# Altium schematic sheet waku-ctl.SchDoc (part 4 of 5)
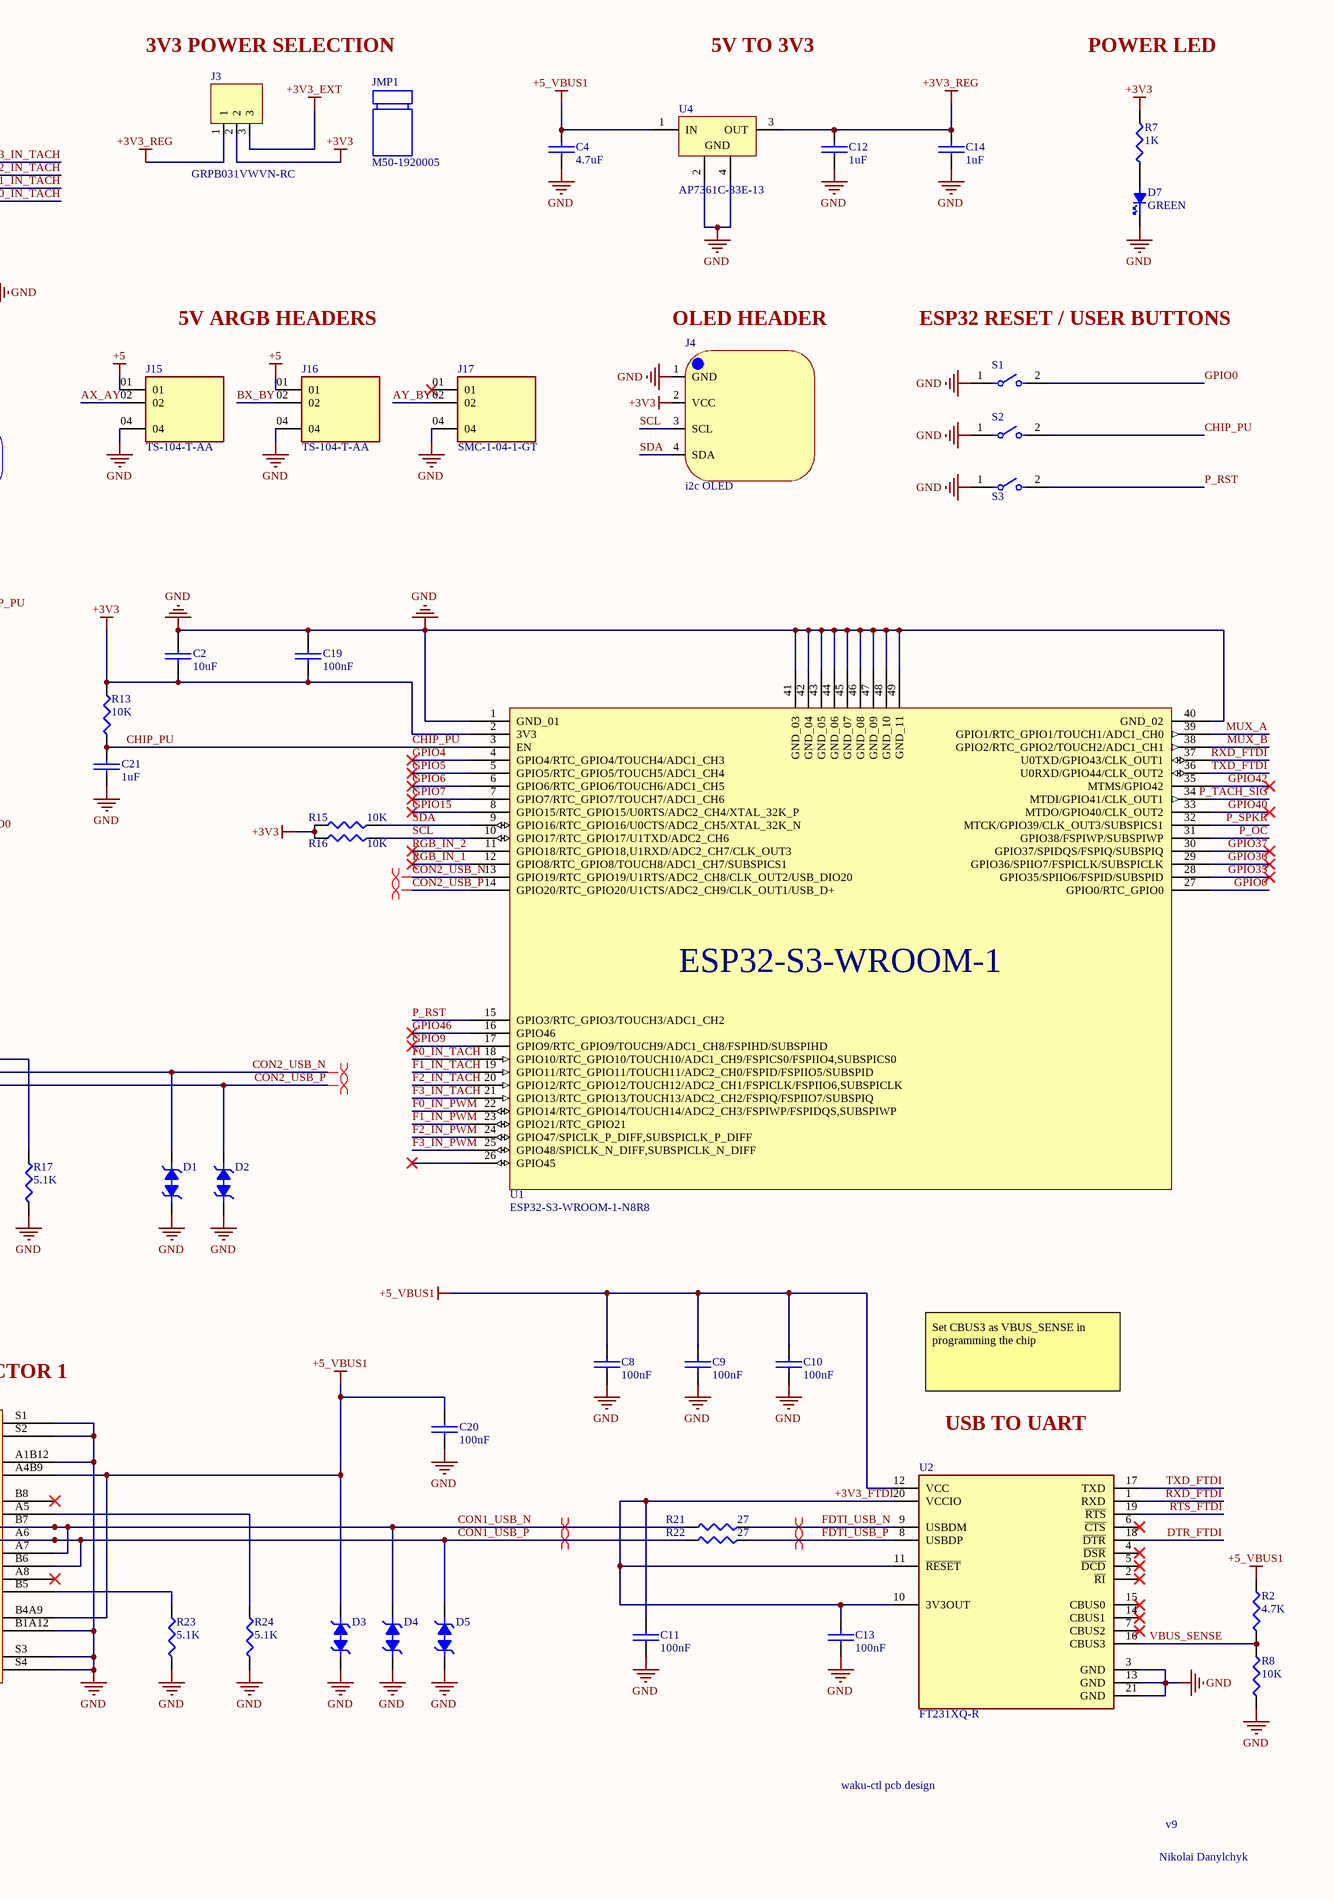
[diagram p4: waku-ctl.SchDoc, right]

## Library data of the parts (continued)
R21 R22 = RC0603FR-0727RL: RES 27 OHM 1% 1/10W 0603; Manufacturer: Yageo Group; Max Power Dissipation: 100mW; Value: 27Ω; Temperature Coefficient: 100ppm/°C; Voltage Rating: 75V; Voltage Rating (AC): 50V; Supplier: DigiKey; Supplier Part Number: 311-27.0HRCT-ND; Manufacturer Part Number: RC0603FR-0727RL; RoHS: Compliant; Category: Chip SMD Resistors; Stock: 368686; Pricing: 1=0.11, 10=0.011, 25=0.0092, 50=0.0052 (USD); Case/Package: 0603; Case Code (Imperial): 0603; China RoHS: Non-Compliant; Composition: Thick Film; Depth: 800µm; Features: Moisture Resistant; Height: 450µm; Lead Free: Lead Free; Length: 1.6mm; Lifecycle Status: Production; Max Operating Temperature: 155°C; Min Operating Temperature: -55°C; Mounting Technology: Surface Mount; Pins: 2; Number of Terminals: 2; Number of Terminations: 2; Packaging: Tape & Reel; Power Dissipation: 100mW; Power Rating: 100mW; REACH SVHC: Yes; Schedule B: 8533210045, 8533210045|8533210045|8533210045|8533210045|8533210045|8533210045|8533210045|8533210045|8533210045|8533210045|8533210045|8533210045|8533210045|8533210045, 8533210045|8533210045|8533210045|8533210045|8533210045|8533210045|8533210045|8533210045|8533210045|8533210045|8533210045|8533210045|8533210045|8533210045|8533210045, 8533210045|8533210045|8533210045|8533210045|8533210045|8533210045|8533210045|8533210045|8533210045|8533210045|8533210045|8533210045|8533210045|8533210045|8533210045|8533210045; Termination: SMD/SMT; Tolerance: 1%; Voltage Rating (DC): 50V; Width: 800µm; Working Voltage: 75V; ComponentLink1URL: https://datasheet.octopart.com:443/RC0603FR-0727RL-Yageo-datasheet-175887523.pdf?src-supplier=Newark; ComponentLink1Description: https://datasheet.octopart.com:443/RC0603FR-0727RL-Yageo-datasheet-175887523.pdf?src-supplier=Newark; ComponentLink2URL: https://datasheet.octopart.com:443/RC0603FR-0727RL-Yageo-datasheet-8328172.pdf?src-supplier=Newark; ComponentLink2Description: https://datasheet.octopart.com:443/RC0603FR-0727RL-Yageo-datasheet-8328172.pdf?src-supplier=Newark; ComponentLink3URL: https://datasheet.octopart.com:443/RC0603FR-0727RL-Yageo-datasheet-34211833.pdf?src-supplier=Newark; ComponentLink3Description: https://datasheet.octopart.com:443/RC0603FR-0727RL-Yageo-datasheet-34211833.pdf?src-supplier=Newark; ComponentLink4URL: https://datasheet.octopart.com:443/RC0603FR-0727RL-Yageo-datasheet-62067350.pdf?src-supplier=Newark; ComponentLink4Description: https://datasheet.octopart.com:443/RC0603FR-0727RL-Yageo-datasheet-62067350.pdf?src-supplier=Newark; ComponentLink5URL: https://datasheet.octopart.com:443/RC0603FR-0727RL-Yageo-datasheet-103092701.pdf?src-supplier=Upverter; ComponentLink5Description: https://datasheet.octopart.com:443/RC0603FR-0727RL-Yageo-datasheet-103092701.pdf?src-supplier=Upverter; ComponentLink6URL: https://datasheet.octopart.com:443/RC0603FR-0727RL-Yageo-datasheet-164759695.pdf?src-supplier=Future+Electronics; ComponentLink6Description: https://datasheet.octopart.com:443/RC0603FR-0727RL-Yageo-datasheet-164759695.pdf?src-supplier=Future+Electronics; ComponentLink7URL: https://datasheet.octopart.com:443/RC0603FR-0727RL-Yageo-datasheet-137700087.pdf?src-supplier=Future+Electronics; ComponentLink7Description: https://datasheet.octopart.com:443/RC0603FR-0727RL-Yageo-datasheet-137700087.pdf?src-supplier=Future+Electronics; ComponentLink8URL: https://datasheet.octopart.com:443/RC0603FR-0727RL-Yageo-datasheet-27584510.pdf?src-supplier=Future+Electronics; ComponentLink8Description: https://datasheet.octopart.com:443/RC0603FR-0727RL-Yageo-datasheet-27584510.pdf?src-supplier=Future+Electronics; ComponentLink9URL: https://datasheet.octopart.com:443/RC0603FR-0727RL-Yageo-datasheet-15599030.pdf?src-supplier=Future+Electronics; ComponentLink9Description: https://datasheet.octopart.com:443/RC0603FR-0727RL-Yageo-datasheet-15599030.pdf?src-supplier=Future+Electronics; ComponentLink10URL: https://datasheet.octopart.com:443/RC0603FR-0727RL-Yageo-datasheet-12596169.pdf?src-supplier=Future+Electronics; ComponentLink10Description: https://datasheet.octopart.com:443/RC0603FR-0727RL-Yageo-datasheet-12596169.pdf?src-supplier=Future+Electronics; ComponentLink11URL: https://datasheet.octopart.com:443/RC0603FR-0727RL-Yageo-datasheet-8324193.pdf?src-supplier=Future+Electronics; ComponentLink11Description: https://datasheet.octopart.com:443/RC0603FR-0727RL-Yageo-datasheet-8324193.pdf?src-supplier=Future+Electronics; ComponentLink12URL: https://datasheet.octopart.com:443/RC0603FR-0727RL-Yageo-datasheet-148775077.pdf?src-supplier=TME; ComponentLink12Description: https://datasheet.octopart.com:443/RC0603FR-0727RL-Yageo-datasheet-148775077.pdf?src-supplier=TME; ComponentLink13URL: https://datasheet.octopart.com/RC0603FR-0727RL-Yageo-datasheet-73766026.pdf; ComponentLink13Description: https://datasheet.octopart.com/RC0603FR-0727RL-Yageo-datasheet-73766026.pdf; ComponentLink14URL: https://datasheet.octopart.com:443/RC0603FR-0727RL-Yageo-datasheet-118562.pdf?src-supplier=DigiKey; ComponentLink14Description: https://datasheet.octopart.com:443/RC0603FR-0727RL-Yageo-datasheet-118562.pdf?src-supplier=DigiKey; ComponentLink15URL: http://sigma.octopart.com:80/rohs_statement/Yageo-company-2.pdf?src-supplier=Compliance+Statements; ComponentLink15Description: http://sigma.octopart.com:80/rohs_statement/Yageo-company-2.pdf?src-supplier=Compliance+Statements; ComponentLink16URL: http://sigma.octopart.com:80/conflict_mineral_statement/Yageo-company-3.pdf?src-supplier=Compliance+Statements; ComponentLink16Description: http://sigma.octopart.com:80/conflict_mineral_statement/Yageo-company-3.pdf?src-supplier=Compliance+Statements; LCSC Part Number: C137753
S1-S3 = PTS636SMG25JSMTRLFS: SWITCH TACTILE SPST-NO 0.05A 12V; Manufacturer: C&K Components; Contact Resistance: 100mΩ; Electrical Life: 70kcycles; Max Current Rating: 50mA; Number of Positions: 1; Operating Force: 2.06N; Sealable: IP40; Throw Configuration: SPST; Supplier: Newark; Supplier Part Number: 41AJ9861; Manufacturer Part Number: PTS636SMG25JSMTRLFS; RoHS: Compliant; Category: Tactile Switches; Stock: 12000; Pricing: 3000=0.155 (USD); Color: White; Height: 1.9mm; Insulation Resistance: 100MΩ; Length: 6.1mm; Lifecycle Status: Production; Max Operating Temperature: 90°C; Max Voltage Rating (DC): 12V; Min Operating Temperature: -40°C; REACH SVHC: Yes; Schedule B: 8536509065; ComponentLink1URL: https://datasheet.octopart.com:443/PTS636SMG25JSMTRLFS-C%26K-Components-datasheet-180017273.pdf?src-supplier=IHS; ComponentLink1Description: https://datasheet.octopart.com:443/PTS636SMG25JSMTRLFS-C%26K-Components-datasheet-180017273.pdf?src-supplier=IHS; ComponentLink2URL: https://datasheet.octopart.com:443/PTS636SMG25JSMTRLFS-C%26K-Components-datasheet-136360845.pdf?src-supplier=Electro+Sonic; ComponentLink2Description: https://datasheet.octopart.com:443/PTS636SMG25JSMTRLFS-C%26K-Components-datasheet-136360845.pdf?src-supplier=Electro+Sonic; LCSC Part Number: C2689642
SATA_POWER = SATA-15pin-power: SATA 15 pin power connector from aliexpress
SPK1 = HC9042-16: Slim speaker from aliexpress; LCSC Part Number: C49246946
U1 = ESP32-S3-WROOM-1-N8R8: ESP32-S3R8 RF TXRX MOD BT WIFI PCB TH SMD; Manufacturer: Espressif Systems; Max Supply Voltage: 3.6V; Min Supply Voltage: 3V; Operating Supply Voltage: 3.3V; Supplier: DigiKey; Supplier Part Number: 5407-ESP32-S3-WROOM-1-N8R8CT-ND; Manufacturer Part Number: ESP32-S3-WROOM-1-N8R8; RoHS: Compliant; Category: System on Chip (SoC); Stock: 10970; Pricing: 1=5.22, 1=6.13, 10=4.528, 10=5.313, 25=5.22, 25=5.0276, 100=3.9504, 100=4.635, 250=3.75, 250=4.39984, 650=4.17352, 1300=4.02062, 1950=3.93533 (EUR); Height - Seated (Max): 3.25mm; Length: 25.5mm; Max Operating Temperature: 65°C; Min Operating Temperature: -40°C; Number of Terminals: 41; Terminal Pitch: 1.27mm; Width: 18mm; ComponentLink1URL: https://datasheet.octopart.com:443/ESP32-S3-WROOM-1-N8R8-Espressif-Systems-datasheet-165560563.pdf?src-supplier=IHS; ComponentLink1Description: https://datasheet.octopart.com:443/ESP32-S3-WROOM-1-N8R8-Espressif-Systems-datasheet-165560563.pdf?src-supplier=IHS; ComponentLink2URL: https://datasheet.octopart.com:443/ESP32-S3-WROOM-1-N8R8-Espressif-Systems-datasheet-175575506.pdf?src-supplier=SOS+electronic; ComponentLink2Description: https://datasheet.octopart.com:443/ESP32-S3-WROOM-1-N8R8-Espressif-Systems-datasheet-175575506.pdf?src-supplier=SOS+electronic; ComponentLink3URL: https://datasheet.octopart.com:443/ESP32-S3-WROOM-1-N8R8-Espressif-Systems-datasheet-164663773.pdf?src-supplier=SOS+electronic; ComponentLink3Description: https://datasheet.octopart.com:443/ESP32-S3-WROOM-1-N8R8-Espressif-Systems-datasheet-164663773.pdf?src-supplier=SOS+electronic; ComponentLink4URL: https://datasheet.octopart.com:443/ESP32-S3-WROOM-1-N8R8-Espressif-Systems-datasheet-188867343.pdf?src-supplier=TME; ComponentLink4Description: https://datasheet.octopart.com:443/ESP32-S3-WROOM-1-N8R8-Espressif-Systems-datasheet-188867343.pdf?src-supplier=TME; ComponentLink5URL: https://datasheet.octopart.com:443/ESP32-S3-WROOM-1-N8R8-Espressif-Systems-datasheet-165560559.pdf?src-supplier=TME; ComponentLink5Description: https://datasheet.octopart.com:443/ESP32-S3-WROOM-1-N8R8-Espressif-Systems-datasheet-165560559.pdf?src-supplier=TME; LCSC Part Number: C2913201; Parameter 1: *
U2 = FT231XQ-R: IC USB SERIAL FULL UART 20QFN; Manufacturer: FTDI; Data Rate: 12Mbps; Interface: UART, USB; Clock Frequency: 12.02MHz; Max Supply Current: 8.4mA; Max Supply Voltage: 5.5V; Min Supply Voltage: 2.97V; Number of Channels: 1; Operating Supply Current: 8mA; Operating Supply Voltage: 5V; Supplier: DigiKey; Supplier Part Number: 768-1128-6-ND; Manufacturer Part Number: FT231XQ-R; RoHS: Compliant; Category: Interface ICs; Pricing: 1=2.34, 25=2.27, 100=2.2, 250=2, 500=1.82002, 1000=1.7625 (USD); Ambient Temperature Range High: 85°C; Case/Package: QFN; Height: 800µm; Height - Seated (Max): 800µm; Lead Free: Lead Free; Length: 4mm; Lifecycle Status: Production; Max Operating Temperature: 85°C; Min Operating Temperature: -40°C; Mounting Technology: Surface Mount; Pins: 20; Number of Terminals: 20; REACH SVHC: Yes; Terminal Pitch: 500µm; Weight: 123.008581mg; Width: 4mm; ComponentLink1URL: https://datasheet.octopart.com:443/FT231XQ-R-FTDI-datasheet-182343132.pdf?src-supplier=IHS; ComponentLink1Description: https://datasheet.octopart.com:443/FT231XQ-R-FTDI-datasheet-182343132.pdf?src-supplier=IHS; ComponentLink2URL: https://datasheet.octopart.com:443/FT231XQ-R-FTDI-datasheet-11021087.pdf?src-supplier=ODG+(Origin+Data+Global); ComponentLink2Description: https://datasheet.octopart.com:443/FT231XQ-R-FTDI-datasheet-11021087.pdf?src-supplier=ODG+(Origin+Data+Global); ComponentLink3URL: https://datasheet.octopart.com:443/FT231XQ-R-FTDI-datasheet-28834672.pdf?src-supplier=SOS+electronic; ComponentLink3Description: https://datasheet.octopart.com:443/FT231XQ-R-FTDI-datasheet-28834672.pdf?src-supplier=SOS+electronic; ComponentLink4URL: https://datasheet.octopart.com:443/FT231XQ-R-FTDI-datasheet-68321328.pdf?src-supplier=TME; ComponentLink4Description: https://datasheet.octopart.com:443/FT231XQ-R-FTDI-datasheet-68321328.pdf?src-supplier=TME; ComponentLink5URL: https://datasheet.octopart.com:443/FT231XQ-R-FTDI-datasheet-134530624.pdf?src-supplier=SHENGYU+ELECTRONICS; ComponentLink5Description: https://datasheet.octopart.com:443/FT231XQ-R-FTDI-datasheet-134530624.pdf?src-supplier=SHENGYU+ELECTRONICS; LCSC Part Number: C132159
U3 = SN74AHCT244PWR: IC BUFF NON-INVERT 5.5V 20-TSSOP; Manufacturer: Texas Instruments; Manufacturer Lifecycle Status: ACTIVE; High Level Output Current: -8mA; Logic Function: Buffer, Inverting; Low Level Output Current: 8mA; Min Supply Voltage: 4.5V; Number of Bits: 8; Number of Bits per Element: 4; Number of Elements: 2; Operating Supply Voltage: 5V; Polarity: Non-Inverting; Propagation Delay: 8.4ns; Quiescent Current: 4µA; Turn-On Delay Time: 13ns; Supplier: DigiKey; Supplier Part Number: 296-1116-1-ND; Manufacturer Part Number: SN74AHCT244PWR; RoHS: Compliant; Category: Buffers, Drivers and Transceivers; Stock: 11683; Pricing: 1=0.43, 10=0.302, 25=0.43, 100=0.2343, 250=0.21744, 500=0.2073, 1000=0.20069 (EUR); Case/Package: TSSOP; Contact Plating: Gold; Height: 0m; Lead Free: Lead Free; Length: 6.5mm; Lifecycle Status: Production; Max Operating Temperature: 85°C; Max Supply Voltage: 5.5V; Min Operating Temperature: -40°C; Mounting Technology: Surface Mount; Number of Input Lines: 8; Number of Inputs: 8; Number of Output Lines: 8; Number of Outputs: 8; Pins: 20; Packaging: Cut Tape; Radiation Hardening: No; REACH SVHC: No; Schedule B: 8542390000, 8542390000|8542390000|8542390000|8542390000|8542390000; Termination: SMD/SMT; Thickness: 1mm; Width: 4.4mm; ComponentLink1URL: https://sigma.octopart.com:443/157851284/technical_drawing/Texas-Instruments-SN74AHCT244PWR.pdf?src-supplier=Texas+Instruments; ComponentLink1Description: https://sigma.octopart.com:443/157851284/technical_drawing/Texas-Instruments-SN74AHCT244PWR.pdf?src-supplier=Texas+Instruments; ComponentLink2URL: https://octopart.com:443/opatz8j6/c1?t=ghJe61n6HiV89-olIjnD38o8K6r9WHTix1tz--1XTpLdkr2Jj0G4zOn4bLiip8ksXJJvDeh_h3XhqV3jFUJDynLYxNoMjyL6NHEpR466wJPtLzw6tBs8gVvIJiLd6aD6UOZIFlskqp0Ep-8gAfLYIZrLVC2xGoymhvH6oXEY9SqN9vbZTloM6avEvf1MB4bD9V1LVp5Lqbi76W7Pl0ucb4l3O25e1vmsXHl0eRZQQtPLcXZwTMNzzJtWnucU1VVaUsawfLREJD5cDAmW7KbiTywpqqWmTFGKRQhdz7VfrRB-SHHmtMjKPksFRvFMQGN1zkEgT_5fzMhbt_l2pvOSM86ovXfmvhbsuKtmu2Jjs9X6CZO94yvkhC5MZAtb2ElL0nUN7tboUw&src-supplier=Texas+Instruments; ComponentLink2Description: https://octopart.com:443/opatz8j6/c1?t=ghJe61n6HiV89-olIjnD38o8K6r9WHTix1tz--1XTpLdkr2Jj0G4zOn4bLiip8ksXJJvDeh_h3XhqV3jFUJDynLYxNoMjyL6NHEpR466wJPtLzw6tBs8gVvIJiLd6aD6UOZIFlskqp0Ep-8gAfLYIZrLVC2xGoymhvH6oXEY9SqN9vbZTloM6avEvf1MB4bD9V1LVp5Lqbi76W7Pl0ucb4l3O25e1vmsXHl0eRZQQtPLcXZwTMNzzJtWnucU1VVaUsawfLREJD5cDAmW7KbiTywpqqWmTFGKRQhdz7VfrRB-SHHmtMjKPksFRvFMQGN1zkEgT_5fzMhbt_l2pvOSM86ovXfmvhbsuKtmu2Jjs9X6CZO94yvkhC5MZAtb2ElL0nUN7tboUw&src-supplier=Texas+Instruments; ComponentLink3URL: https://datasheet.octopart.com:443/SN74AHCT244PWR-Texas-Instruments-datasheet-41214155.pdf?src-supplier=Texas+Instruments; ComponentLink3Description: https://datasheet.octopart.com:443/SN74AHCT244PWR-Texas-Instruments-datasheet-41214155.pdf?src-supplier=Texas+Instruments; ComponentLink4URL: https://datasheet.octopart.com:443/SN74AHCT244PWR-Texas-Instruments-datasheet-10254144.pdf?src-supplier=Texas+Instruments; ComponentLink4Description: https://datasheet.octopart.com:443/SN74AHCT244PWR-Texas-Instruments-datasheet-10254144.pdf?src-supplier=Texas+Instruments; ComponentLink5URL: https://sigma.octopart.com:443/49249835/technical_drawing/Texas-Instruments-SN74AHCT244PWR.pdf?src-supplier=Texas+Instruments; ComponentLink5Description: https://sigma.octopart.com:443/49249835/technical_drawing/Texas-Instruments-SN74AHCT244PWR.pdf?src-supplier=Texas+Instruments; ComponentLink6URL: https://datasheet.octopart.com:443/SN74AHCT244PWR-Texas-Instruments-datasheet-152663.pdf?src-supplier=Texas+Instruments; ComponentLink6Description: https://datasheet.octopart.com:443/SN74AHCT244PWR-Texas-Instruments-datasheet-152663.pdf?src-supplier=Texas+Instruments; ComponentLink7URL: https://datasheet.octopart.com:443/SN74AHCT244PWR-Texas-Instruments-datasheet-27606291.pdf?src-supplier=element14+APAC; ComponentLink7Description: https://datasheet.octopart.com:443/SN74AHCT244PWR-Texas-Instruments-datasheet-27606291.pdf?src-supplier=element14+APAC; ComponentLink8URL: https://datasheet.octopart.com:443/SN74AHCT244PWR-Texas-Instruments-datasheet-21133542.pdf?src-supplier=element14+APAC; ComponentLink8Description: https://datasheet.octopart.com:443/SN74AHCT244PWR-Texas-Instruments-datasheet-21133542.pdf?src-supplier=element14+APAC; ComponentLink9URL: https://datasheet.octopart.com:443/SN74AHCT244PWR-Texas-Instruments-datasheet-27203569.pdf?src-supplier=element14+APAC; ComponentLink9Description: https://datasheet.octopart.com:443/SN74AHCT244PWR-Texas-Instruments-datasheet-27203569.pdf?src-supplier=element14+APAC; ComponentLink10URL: https://datasheet.octopart.com:443/SN74AHCT244PWR-Texas-Instruments-datasheet-25360952.pdf?src-supplier=element14+APAC; ComponentLink10Description: https://datasheet.octopart.com:443/SN74AHCT244PWR-Texas-Instruments-datasheet-25360952.pdf?src-supplier=element14+APAC; ComponentLink11URL: https://datasheet.octopart.com:443/SN74AHCT244PWR-Texas-Instruments-datasheet-65863357.pdf?src-supplier=Farnell; ComponentLink11Description: https://datasheet.octopart.com:443/SN74AHCT244PWR-Texas-Instruments-datasheet-65863357.pdf?src-supplier=Farnell; ComponentLink12URL: https://datasheet.octopart.com:443/SN74AHCT244PWR-Texas-Instruments-datasheet-11523990.pdf?src-supplier=Farnell; ComponentLink12Description: https://datasheet.octopart.com:443/SN74AHCT244PWR-Texas-Instruments-datasheet-11523990.pdf?src-supplier=Farnell; ComponentLink13URL: https://datasheet.octopart.com:443/SN74AHCT244PWR-Texas-Instruments-datasheet-11003095.pdf?src-supplier=Farnell; ComponentLink13Description: https://datasheet.octopart.com:443/SN74AHCT244PWR-Texas-Instruments-datasheet-11003095.pdf?src-supplier=Farnell; ComponentLink14URL: https://datasheet.octopart.com:443/SN74AHCT244PWR-Texas-Instruments-datasheet-8361317.pdf?src-supplier=Newark; ComponentLink14Description: https://datasheet.octopart.com:443/SN74AHCT244PWR-Texas-Instruments-datasheet-8361317.pdf?src-supplier=Newark; ComponentLink15URL: https://datasheet.octopart.com:443/SN74AHCT244PWR-Texas-Instruments-datasheet-5317733.pdf?src-supplier=Newark; ComponentLink15Description: https://datasheet.octopart.com:443/SN74AHCT244PWR-Texas-Instruments-datasheet-5317733.pdf?src-supplier=Newark; ComponentLink16URL: https://datasheet.octopart.com:443/SN74AHCT244PWR-Texas-Instruments-datasheet-166100610.pdf?src-supplier=Augswan; ComponentLink16Description: https://datasheet.octopart.com:443/SN74AHCT244PWR-Texas-Instruments-datasheet-166100610.pdf?src-supplier=Augswan; ComponentLink17URL: https://datasheet.octopart.com:443/SN74AHCT244PWR-Texas-Instruments-datasheet-164411996.pdf?src-supplier=SHENGYU+ELECTRONICS; ComponentLink17Description: https://datasheet.octopart.com:443/SN74AHCT244PWR-Texas-Instruments-datasheet-164411996.pdf?src-supplier=SHENGYU+ELECTRONICS; ComponentLink18URL: https://datasheet.octopart.com:443/SN74AHCT244PWR-Texas-Instruments-datasheet-159115862.pdf?src-supplier=LCSC; ComponentLink18Description: https://datasheet.octopart.com:443/SN74AHCT244PWR-Texas-Instruments-datasheet-159115862.pdf?src-supplier=LCSC; ComponentLink19URL: https://datasheet.octopart.com:443/SN74AHCT244PWR-Texas-Instruments-datasheet-17022234.pdf?src-supplier=Factory+Futures; ComponentLink19Description: https://datasheet.octopart.com:443/SN74AHCT244PWR-Texas-Instruments-datasheet-17022234.pdf?src-supplier=Factory+Futures; ComponentLink20URL: https://datasheet.octopart.com:443/SN74AHCT244PWR-Texas-Instruments-datasheet-14144309.pdf?src-supplier=iiiC; ComponentLink20Description: https://datasheet.octopart.com:443/SN74AHCT244PWR-Texas-Instruments-datasheet-14144309.pdf?src-supplier=iiiC; ComponentLink21URL: https://datasheet.octopart.com:443/SN74AHCT244PWR-Texas-Instruments-datasheet-7556590.pdf?src-supplier=Jameco; ComponentLink21Description: https://datasheet.octopart.com:443/SN74AHCT244PWR-Texas-Instruments-datasheet-7556590.pdf?src-supplier=Jameco; ComponentLink22URL: https://datasheet.octopart.com:443/SN74AHCT244PWR-Texas-Instruments-datasheet-115050.pdf?src-supplier=Sierra+IC; ComponentLink22Description: https://datasheet.octopart.com:443/SN74AHCT244PWR-Texas-Instruments-datasheet-115050.pdf?src-supplier=Sierra+IC; ComponentLink23URL: https://datasheet.octopart.com:443/SN74AHCT244PWR-Texas-Instruments-datasheet-2641.pdf?src-supplier=DigiKey; ComponentLink23Description: https://datasheet.octopart.com:443/SN74AHCT244PWR-Texas-Instruments-datasheet-2641.pdf?src-supplier=DigiKey; ComponentLink24URL: http://sigma.octopart.com:80/conflict_mineral_statement/Texas-Instruments-company-63.pdf?src-supplier=Compliance+Statements; ComponentLink24Description: http://sigma.octopart.com:80/conflict_mineral_statement/Texas-Instruments-company-63.pdf?src-supplier=Compliance+Statements; ComponentLink25URL: http://sigma.octopart.com:80/reach_statement/Texas-Instruments-company-64.pdf?src-supplier=Compliance+Statements; ComponentLink25Description: http://sigma.octopart.com:80/reach_statement/Texas-Instruments-company-64.pdf?src-supplier=Compliance+Statements; LCSC Part Number: C484743
U4 = AP7361C-33E-13: IC REG LINEAR 3.3V 1A SOT-223-3; Manufacturer: Diodes Inc.; Dropout Voltage: 360mV; Max Supply Voltage: 6V; Max Junction Temperature (Tj): 150°C; Min Current Limit: 1.1A; Min Input Voltage: 4.3V; Number of Channels: 1; Voltage Tolerance: 1%; Supplier: DigiKey; Supplier Part Number: AP7361C-33E-13DICT-ND; Manufacturer Part Number: AP7361C-33E-13; RoHS: Compliant; Category: LDO Voltage Regulators; Stock: 4888; Pricing: 1=0.39, 10=0.274, 25=0.39, 100=0.2121, 250=0.19664, 500=0.1873, 1000=0.17961 (EUR); Case/Package: TO-261-4; China RoHS: Compliant; Height - Seated (Max): 1.8mm; Length: 6.5mm; Lifecycle Status: Production; Max Operating Temperature: 85°C; Min Operating Temperature: -40°C; Mounting Technology: Surface Mount; Number of Circuits: 1; Pins: 3; Number of Regulators: 1; Number of Terminals: 3; Output Current: 1A; Output Voltage: 3.3V; REACH SVHC: Yes; Schedule B: 8542390000, 8542390000|8542390000|8542390000|8542390000|8542390000; Terminal Pitch: 2.3mm; Width: 3.5mm; ComponentLink1URL: https://datasheet.octopart.com:443/AP7361C-33E-13-Diodes-Inc.-datasheet-159616639.pdf?src-supplier=IHS; ComponentLink1Description: https://datasheet.octopart.com:443/AP7361C-33E-13-Diodes-Inc.-datasheet-159616639.pdf?src-supplier=IHS; ComponentLink2URL: https://datasheet.octopart.com:443/AP7361C-33E-13-Diodes-Inc.-datasheet-101745716.pdf?src-supplier=Future+Electronics; ComponentLink2Description: https://datasheet.octopart.com:443/AP7361C-33E-13-Diodes-Inc.-datasheet-101745716.pdf?src-supplier=Future+Electronics; ComponentLink3URL: https://datasheet.octopart.com:443/AP7361C-33E-13-Diodes-Inc.-datasheet-158996477.pdf?src-supplier=SHENGYU+ELECTRONICS; ComponentLink3Description: https://datasheet.octopart.com:443/AP7361C-33E-13-Diodes-Inc.-datasheet-158996477.pdf?src-supplier=SHENGYU+ELECTRONICS; LCSC Part Number: C500795
U5 = CD74HCT4053PWR: IC SWITCH SPDTX3 130OHM 16TSSOP; Manufacturer: Texas Instruments; Manufacturer Lifecycle Status: ACTIVE; Bandwidth: 200MHz; Dual Supply Voltage: 3V; High Level Output Current: 25mA; Logic Function: Demultiplexer, Multiplexer; Max Dual Supply Voltage: 5V; Max Supply Voltage: 5.5V; Min Dual Supply Voltage: 1V; Min Supply Voltage: 4.5V; Nominal Supply Current: 16µA; Number of Bits: 2; Number of Circuits: 1; Number of Inputs: 6; Number of Outputs: 3; Polarity: Non-Inverting; Propagation Delay: 12ns; Value: 130Ω; Supply Type: Dual, Single; Throw Configuration: SPDT; Turn-Off Delay Time: 44ns; Turn-On Delay Time: 48ns; Supplier: DigiKey; Supplier Part Number: 296-9279-1-ND; Manufacturer Part Number: CD74HCT4053PWR; RoHS: Compliant; Category: Analog Switches and Multiplexers; Stock: 5404; Pricing: 1=0.39, 10=0.271, 25=0.39, 100=0.2099, 250=0.19452, 500=0.18526, 1000=0.17839 (EUR); Case/Package: TSSOP; Contact Plating: Gold; Height: 1.2mm; Lead Free: Lead Free; Length: 5mm; Lifecycle Status: Production; Low Level Output Current: 25mA; Max Operating Temperature: 125°C; Min Operating Temperature: -55°C; Mounting Technology: Surface Mount; Number of Channels: 2; Pins: 16; Operating Supply Voltage: 5V; Packaging: Cut Tape; Radiation Hardening: No; Schedule B: 8542390000, 8542390000|8542390000|8542390000|8542390000|8542390000; Thickness: 1mm; Weight: 61.887009mg; Width: 4.4mm; ComponentLink1URL: https://sigma.octopart.com:443/189718192/technical_drawing/Texas-Instruments-CD74HCT4053PWR.pdf?src-supplier=Texas+Instruments; ComponentLink1Description: https://sigma.octopart.com:443/189718192/technical_drawing/Texas-Instruments-CD74HCT4053PWR.pdf?src-supplier=Texas+Instruments; ComponentLink2URL: https://octopart.com:443/opatz8j6/c1?t=r_EXInCMpPACudhKHzZ8bO5bgSUH3J-qCdRFK7eM-zh2CG9zjUf3zSY1pJujiAxLsrBmH7g8iNICbwVvUDjupCTvpSm23ziT2Rsf8v0JwFdr4nhEGUs8X3qbimKNF4sojUm_sdC48My8RX7newMZQsim8ypD0oplg5H23-Zskb2gpnOwYzN2IxOyKiO0U3m98B2y_JhJSXv1aloE7x8_ft6wIJAiwzPng7kHihF-WIR8yKUl-8_XFKfUm0lqx9F5E99EkWYyZ6glj6wGdA3pMxEu2ukoUMqXVhiEYiL-qtiowiB2hQCVoeQkf6zOjxPA9C3zMK9RAjvLXxGaNaoGjjy9WRMsekgvf89phFeZKXqLTg-uMU4c_tvOGxuAsuLkZsmYt2Jz8Q&src-supplier=Texas+Instruments; ComponentLink2Description: https://octopart.com:443/opatz8j6/c1?t=r_EXInCMpPACudhKHzZ8bO5bgSUH3J-qCdRFK7eM-zh2CG9zjUf3zSY1pJujiAxLsrBmH7g8iNICbwVvUDjupCTvpSm23ziT2Rsf8v0JwFdr4nhEGUs8X3qbimKNF4sojUm_sdC48My8RX7newMZQsim8ypD0oplg5H23-Zskb2gpnOwYzN2IxOyKiO0U3m98B2y_JhJSXv1aloE7x8_ft6wIJAiwzPng7kHihF-WIR8yKUl-8_XFKfUm0lqx9F5E99EkWYyZ6glj6wGdA3pMxEu2ukoUMqXVhiEYiL-qtiowiB2hQCVoeQkf6zOjxPA9C3zMK9RAjvLXxGaNaoGjjy9WRMsekgvf89phFeZKXqLTg-uMU4c_tvOGxuAsuLkZsmYt2Jz8Q&src-supplier=Texas+Instruments; ComponentLink3URL: https://datasheet.octopart.com:443/CD74HCT4053PWR-Texas-Instruments-datasheet-41204773.pdf?src-supplier=Texas+Instruments; ComponentLink3Description: https://datasheet.octopart.com:443/CD74HCT4053PWR-Texas-Instruments-datasheet-41204773.pdf?src-supplier=Texas+Instruments; ComponentLink4URL: https://sigma.octopart.com:443/116621398/technical_drawing/Texas-Instruments-CD74HCT4053PWR.pdf?src-supplier=Texas+Instruments; ComponentLink4Description: https://sigma.octopart.com:443/116621398/technical_drawing/Texas-Instruments-CD74HCT4053PWR.pdf?src-supplier=Texas+Instruments; ComponentLink5URL: https://sigma.octopart.com:443/49249815/technical_drawing/Texas-Instruments-CD74HCT4053PWR.pdf?src-supplier=Texas+Instruments; ComponentLink5Description: https://sigma.octopart.com:443/49249815/technical_drawing/Texas-Instruments-CD74HCT4053PWR.pdf?src-supplier=Texas+Instruments; ComponentLink6URL: https://datasheet.octopart.com:443/CD74HCT4053PWR-Texas-Instruments-datasheet-150011.pdf?src-supplier=Mouser; ComponentLink6Description: https://datasheet.octopart.com:443/CD74HCT4053PWR-Texas-Instruments-datasheet-150011.pdf?src-supplier=Mouser; ComponentLink7URL: https://datasheet.octopart.com:443/CD74HCT4053PWR-Texas-Instruments-datasheet-89139790.pdf?src-supplier=TME; ComponentLink7Description: https://datasheet.octopart.com:443/CD74HCT4053PWR-Texas-Instruments-datasheet-89139790.pdf?src-supplier=TME; ComponentLink8URL: https://datasheet.octopart.com:443/CD74HCT4053PWR-Texas-Instruments-datasheet-165803830.pdf?src-supplier=LCSC; ComponentLink8Description: https://datasheet.octopart.com:443/CD74HCT4053PWR-Texas-Instruments-datasheet-165803830.pdf?src-supplier=LCSC; ComponentLink9URL: https://datasheet.octopart.com:443/CD74HCT4053PWR-Texas-Instruments-datasheet-164413548.pdf?src-supplier=SHENGYU+ELECTRONICS; ComponentLink9Description: https://datasheet.octopart.com:443/CD74HCT4053PWR-Texas-Instruments-datasheet-164413548.pdf?src-supplier=SHENGYU+ELECTRONICS; ComponentLink10URL: https://datasheet.octopart.com:443/CD74HCT4053PWR-Texas-Instruments-datasheet-31668943.pdf?src-supplier=Newark; ComponentLink10Description: https://datasheet.octopart.com:443/CD74HCT4053PWR-Texas-Instruments-datasheet-31668943.pdf?src-supplier=Newark; ComponentLink11URL: https://datasheet.octopart.com:443/CD74HCT4053PWR-Texas-Instruments-datasheet-21220249.pdf?src-supplier=Newark; ComponentLink11Description: https://datasheet.octopart.com:443/CD74HCT4053PWR-Texas-Instruments-datasheet-21220249.pdf?src-supplier=Newark; ComponentLink12URL: https://datasheet.octopart.com:443/CD74HCT4053PWR-Texas-Instruments-datasheet-14119461.pdf?src-supplier=iiiC; ComponentLink12Description: https://datasheet.octopart.com:443/CD74HCT4053PWR-Texas-Instruments-datasheet-14119461.pdf?src-supplier=iiiC; ComponentLink13URL: https://datasheet.octopart.com:443/CD74HCT4053PWR-Texas-Instruments-datasheet-11517245.pdf?src-supplier=Arrow+Electronics; ComponentLink13Description: https://datasheet.octopart.com:443/CD74HCT4053PWR-Texas-Instruments-datasheet-11517245.pdf?src-supplier=Arrow+Electronics; ComponentLink14URL: https://datasheet.octopart.com:443/CD74HCT4053PWR-Texas-Instruments-datasheet-115721.pdf?src-supplier=Sierra+IC; ComponentLink14Description: https://datasheet.octopart.com:443/CD74HCT4053PWR-Texas-Instruments-datasheet-115721.pdf?src-supplier=Sierra+IC; ComponentLink15URL: https://datasheet.octopart.com:443/CD74HCT4053PWR-Texas-Instruments-datasheet-4176.pdf?src-supplier=DigiKey; ComponentLink15Description: https://datasheet.octopart.com:443/CD74HCT4053PWR-Texas-Instruments-datasheet-4176.pdf?src-supplier=DigiKey; ComponentLink16URL: http://sigma.octopart.com:80/conflict_mineral_statement/Texas-Instruments-company-63.pdf?src-supplier=Compliance+Statements; ComponentLink16Description: http://sigma.octopart.com:80/conflict_mineral_statement/Texas-Instruments-company-63.pdf?src-supplier=Compliance+Statements; ComponentLink17URL: http://sigma.octopart.com:80/reach_statement/Texas-Instruments-company-64.pdf?src-supplier=Compliance+Statements; ComponentLink17Description: http://sigma.octopart.com:80/reach_statement/Texas-Instruments-company-64.pdf?src-supplier=Compliance+Statements; LCSC Part Number: C2673103
U6 = ADS1115IDGSR: IC ADC 16BIT SIGMA-DELTA 10VSSOP; Manufacturer: Texas Instruments; Manufacturer Lifecycle Status: ACTIVE; Conversion Rate: 860sps; Integral Nonlinearity (INL): 1LSB; Interface: I2C; Max Junction Temperature (Tj): 150°C; Max Supply Voltage: 5.5V; Min Supply Voltage: 2V; Nominal Supply Current: 150µA; Number of A/D Converters: 1; Number of Bits: 16; Number of Channels: 2; Number of Inputs: 4; Polarity: Bipolar; Power Dissipation: 900µW; Resolution: 2B; Supply Type: Single; Supplier: DigiKey; Supplier Part Number: 296-38849-1-ND; Manufacturer Part Number: ADS1115IDGSR; RoHS: Compliant; Category: Analog to Digital Converters (ADCs); Stock: 9217; Pricing: 1=4.36, 10=3.329, 25=4.36, 100=2.785, 250=2.64912, 500=2.56724, 1000=2.49986 (EUR); Ambient Temperature Range High: 125°C; Case/Package: VSSOP; Contact Plating: Gold; Height: 1.07mm; Lead Free: Lead Free; Length: 3mm; Lifecycle Status: Production; Max Operating Temperature: 125°C; Max Supply Voltage (DC): 5.5V; Min Operating Temperature: -40°C; Min Supply Voltage (DC): 2V; Number of Converters: 1; Pins: 10; Radiation Hardening: No; REACH SVHC: No; Sampling Rate: 860sps; Schedule B: 8542390000, 8542390000|8542390000|8542390000|8542390000|8542390000; Thickness: 1.02mm; Width: 3mm; ComponentLink1URL: https://datasheet.octopart.com:443/ADS1115IDGSR-Texas-Instruments-datasheet-21818186.pdf?src-supplier=Newark; ComponentLink1Description: https://datasheet.octopart.com:443/ADS1115IDGSR-Texas-Instruments-datasheet-21818186.pdf?src-supplier=Newark; ComponentLink2URL: https://octopart.com:443/opatz8j6/c1?t=IuqcA-XNANVnUgh6bO5qed4pAqyN2BqXsIjLAySB2Hr-eHtD8pK9l6OOA6AGsTuVanxQmOkBsFQN-rlHciEN_k6CTJvcjzCJlSq-wVqGrNuiBwTkWy4ml0ROCJtQ1-lij77U2D_WoJ3znwfT0mMt9ikQ9I9gRMar-xW9CqMxsY2FjbMMvAysjMOkXQ1FlQyveQwqsSa6_aCP81y3rIEwyR4aAdYLYQAG9CvpdWj9_mOw_IWbI1A0mS4Nr3T47cwXgL4gd3vwJQBENC_vJJ1ljWY6eimCFVEfMSp8To8QyZoXqbl__zcnRO1ari-Z50yUygNu99GuoBJUHWWpTBL6cSd8XR7eVfe8TQCRE2bK5TYPZsJNK_jD7hLJEK0orzhEdbBg33g&src-supplier=Texas+Instruments; ComponentLink2Description: https://octopart.com:443/opatz8j6/c1?t=IuqcA-XNANVnUgh6bO5qed4pAqyN2BqXsIjLAySB2Hr-eHtD8pK9l6OOA6AGsTuVanxQmOkBsFQN-rlHciEN_k6CTJvcjzCJlSq-wVqGrNuiBwTkWy4ml0ROCJtQ1-lij77U2D_WoJ3znwfT0mMt9ikQ9I9gRMar-xW9CqMxsY2FjbMMvAysjMOkXQ1FlQyveQwqsSa6_aCP81y3rIEwyR4aAdYLYQAG9CvpdWj9_mOw_IWbI1A0mS4Nr3T47cwXgL4gd3vwJQBENC_vJJ1ljWY6eimCFVEfMSp8To8QyZoXqbl__zcnRO1ari-Z50yUygNu99GuoBJUHWWpTBL6cSd8XR7eVfe8TQCRE2bK5TYPZsJNK_jD7hLJEK0orzhEdbBg33g&src-supplier=Texas+Instruments; ComponentLink3URL: https://datasheet.octopart.com:443/ADS1115IDGSR-Texas-Instruments-datasheet-10254488.pdf?src-supplier=Texas+Instruments; ComponentLink3Description: https://datasheet.octopart.com:443/ADS1115IDGSR-Texas-Instruments-datasheet-10254488.pdf?src-supplier=Texas+Instruments; ComponentLink4URL: https://datasheet.octopart.com:443/ADS1115IDGSR-Texas-Instruments-datasheet-10258908.pdf?src-supplier=Texas+Instruments; ComponentLink4Description: https://datasheet.octopart.com:443/ADS1115IDGSR-Texas-Instruments-datasheet-10258908.pdf?src-supplier=Texas+Instruments; ComponentLink5URL: https://sigma.octopart.com:443/49250172/technical_drawing/Texas-Instruments-ADS1115IDGSR.pdf?src-supplier=Texas+Instruments; ComponentLink5Description: https://sigma.octopart.com:443/49250172/technical_drawing/Texas-Instruments-ADS1115IDGSR.pdf?src-supplier=Texas+Instruments; ComponentLink6URL: https://datasheet.octopart.com:443/ADS1115IDGSR-Texas-Instruments-datasheet-159114584.pdf?src-supplier=LCSC; ComponentLink6Description: https://datasheet.octopart.com:443/ADS1115IDGSR-Texas-Instruments-datasheet-159114584.pdf?src-supplier=LCSC; ComponentLink7URL: https://datasheet.octopart.com:443/ADS1115IDGSR-Texas-Instruments-datasheet-164412415.pdf?src-supplier=SHENGYU+ELECTRONICS; ComponentLink7Description: https://datasheet.octopart.com:443/ADS1115IDGSR-Texas-Instruments-datasheet-164412415.pdf?src-supplier=SHENGYU+ELECTRONICS; ComponentLink8URL: https://datasheet.octopart.com:443/ADS1115IDGSR-Texas-Instruments-datasheet-78774318.pdf?src-supplier=Farnell; ComponentLink8Description: https://datasheet.octopart.com:443/ADS1115IDGSR-Texas-Instruments-datasheet-78774318.pdf?src-supplier=Farnell; ComponentLink9URL: https://datasheet.octopart.com:443/ADS1115IDGSR-Texas-Instruments-datasheet-150582607.pdf?src-supplier=Arrow.cn; ComponentLink9Description: https://datasheet.octopart.com:443/ADS1115IDGSR-Texas-Instruments-datasheet-150582607.pdf?src-supplier=Arrow.cn; ComponentLink10URL: https://datasheet.octopart.com:443/ADS1115IDGSR-Texas-Instruments-datasheet-14070808.pdf?src-supplier=iiiC; ComponentLink10Description: https://datasheet.octopart.com:443/ADS1115IDGSR-Texas-Instruments-datasheet-14070808.pdf?src-supplier=iiiC; ComponentLink11URL: http://sigma.octopart.com:80/conflict_mineral_statement/Texas-Instruments-company-63.pdf?src-supplier=Compliance+Statements; ComponentLink11Description: http://sigma.octopart.com:80/conflict_mineral_statement/Texas-Instruments-company-63.pdf?src-supplier=Compliance+Statements; ComponentLink12URL: http://sigma.octopart.com:80/reach_statement/Texas-Instruments-company-64.pdf?src-supplier=Compliance+Statements; ComponentLink12Description: http://sigma.octopart.com:80/reach_statement/Texas-Instruments-company-64.pdf?src-supplier=Compliance+Statements; LCSC Part Number: C37593
U7 = SN74LVC125APWR: IC BUFF NON-INVERT 3.6V 14-TSSOP; Manufacturer: Texas Instruments; Manufacturer Lifecycle Status: ACTIVE; High Level Output Current: -24mA; Logic Function: Buffer, Inverting; Low Level Output Current: 24mA; Max Power Dissipation: 500mW; Min Supply Voltage: 1.65V; Nominal Supply Current: 1µA; Number of Bits: 4; Number of Bits per Element: 1; Number of Output Lines: 3; Polarity: Non-Inverting; Propagation Delay: 3ns; Turn-On Delay Time: 5.3ns; Supplier: DigiKey; Supplier Part Number: 296-1222-1-ND; Manufacturer Part Number: SN74LVC125APWR; RoHS: Compliant; Category: Buffers, Drivers and Transceivers; Pricing: 1=0.32, 10=0.22, 25=0.32, 100=0.169, 250=0.15624, 500=0.14854, 1000=0.14221 (EUR); Case/Package: TSSOP; Contact Plating: Gold; Height: 0m; Lead Free: Lead Free; Length: 5mm; Lifecycle Status: Production; Max Operating Temperature: 125°C; Max Supply Voltage: 3.6V; Min Operating Temperature: -40°C; Mounting Technology: Surface Mount; Number of Channels: 4; Number of Circuits: 4; Number of Elements: 4; Number of Gates: 4; Number of Input Lines: 4; Number of Inputs: 4; Number of Outputs: 4; Pins: 14; Quiescent Current: 1µA; Radiation Hardening: No; REACH SVHC: No; Schedule B: 8542390000, 8542390000|8542390000|8542390000|8542390000|8542390000; Termination: SMD/SMT; Thickness: 1mm; Width: 4.4mm; ComponentLink1URL: https://sigma.octopart.com:443/182471031/technical_drawing/Texas-Instruments-SN74LVC125APWR.pdf?src-supplier=Texas+Instruments; ComponentLink1Description: https://sigma.octopart.com:443/182471031/technical_drawing/Texas-Instruments-SN74LVC125APWR.pdf?src-supplier=Texas+Instruments; ComponentLink2URL: https://octopart.com:443/opatz8j6/c1?t=m7tao46Cp5BsUR2xromxzcu3oyl3UTX2gSNpLcE7RSWnyA1bQlshO2PU7CYxg6hfD9UrHGXilfRXLnjlrfE5w5kuYWmj-tJCYobuLsDToAOK1nIBV0ONYcJLH1_lESx9fviRCOW4VE7n0ZX3Hmg4ZcGY_rK9D-_gs0tQkOIQzTQmwu3Ya5qSTNAkHV7h3Z-kGtrXzc7b3YEboIecKnWr6GWore2FsFKhC6Lr9KwAgRBdK9X6SrQOo5Eb11oGInVgxhKaIWuGbajALS1G30ssv9H2oVfdBG0eVA0umxvZs4CxE-QhSBDAdp1FUXwVZ_l4bHMif_Slmx_GFebhfHJwZRz9uFheQxDe-vdWkP1MZL1g_AEC6eOsKIj10qOuI-F5FmlBkyTL2A&src-supplier=Texas+Instruments; ComponentLink2Description: https://octopart.com:443/opatz8j6/c1?t=m7tao46Cp5BsUR2xromxzcu3oyl3UTX2gSNpLcE7RSWnyA1bQlshO2PU7CYxg6hfD9UrHGXilfRXLnjlrfE5w5kuYWmj-tJCYobuLsDToAOK1nIBV0ONYcJLH1_lESx9fviRCOW4VE7n0ZX3Hmg4ZcGY_rK9D-_gs0tQkOIQzTQmwu3Ya5qSTNAkHV7h3Z-kGtrXzc7b3YEboIecKnWr6GWore2FsFKhC6Lr9KwAgRBdK9X6SrQOo5Eb11oGInVgxhKaIWuGbajALS1G30ssv9H2oVfdBG0eVA0umxvZs4CxE-QhSBDAdp1FUXwVZ_l4bHMif_Slmx_GFebhfHJwZRz9uFheQxDe-vdWkP1MZL1g_AEC6eOsKIj10qOuI-F5FmlBkyTL2A&src-supplier=Texas+Instruments; ComponentLink3URL: https://datasheet.octopart.com:443/SN74LVC125APWR-Texas-Instruments-datasheet-10254735.pdf?src-supplier=Texas+Instruments; ComponentLink3Description: https://datasheet.octopart.com:443/SN74LVC125APWR-Texas-Instruments-datasheet-10254735.pdf?src-supplier=Texas+Instruments; ComponentLink4URL: https://sigma.octopart.com:443/49249819/technical_drawing/Texas-Instruments-SN74LVC125APWR.pdf?src-supplier=Texas+Instruments; ComponentLink4Description: https://sigma.octopart.com:443/49249819/technical_drawing/Texas-Instruments-SN74LVC125APWR.pdf?src-supplier=Texas+Instruments; ComponentLink5URL: https://datasheet.octopart.com:443/SN74LVC125APWR-Texas-Instruments-datasheet-150516.pdf?src-supplier=Texas+Instruments; ComponentLink5Description: https://datasheet.octopart.com:443/SN74LVC125APWR-Texas-Instruments-datasheet-150516.pdf?src-supplier=Texas+Instruments; ComponentLink6URL: https://datasheet.octopart.com:443/SN74LVC125APWR-Texas-Instruments-datasheet-37101729.pdf?src-supplier=Farnell; ComponentLink6Description: https://datasheet.octopart.com:443/SN74LVC125APWR-Texas-Instruments-datasheet-37101729.pdf?src-supplier=Farnell; ComponentLink7URL: https://datasheet.octopart.com:443/SN74LVC125APWR-Texas-Instruments-datasheet-8815742.pdf?src-supplier=Farnell; ComponentLink7Description: https://datasheet.octopart.com:443/SN74LVC125APWR-Texas-Instruments-datasheet-8815742.pdf?src-supplier=Farnell; ComponentLink8URL: https://datasheet.octopart.com:443/SN74LVC125APWR-Texas-Instruments-datasheet-8758542.pdf?src-supplier=Farnell; ComponentLink8Description: https://datasheet.octopart.com:443/SN74LVC125APWR-Texas-Instruments-datasheet-8758542.pdf?src-supplier=Farnell; ComponentLink9URL: https://datasheet.octopart.com:443/SN74LVC125APWR-Texas-Instruments-datasheet-8384538.pdf?src-supplier=Farnell; ComponentLink9Description: https://datasheet.octopart.com:443/SN74LVC125APWR-Texas-Instruments-datasheet-8384538.pdf?src-supplier=Farnell; ComponentLink10URL: https://datasheet.octopart.com:443/SN74LVC125APWR-Texas-Instruments-datasheet-8141996.pdf?src-supplier=Farnell; ComponentLink10Description: https://datasheet.octopart.com:443/SN74LVC125APWR-Texas-Instruments-datasheet-8141996.pdf?src-supplier=Farnell; ComponentLink11URL: https://datasheet.octopart.com:443/SN74LVC125APWR-Texas-Instruments-datasheet-5375601.pdf?src-supplier=Farnell; ComponentLink11Description: https://datasheet.octopart.com:443/SN74LVC125APWR-Texas-Instruments-datasheet-5375601.pdf?src-supplier=Farnell; ComponentLink12URL: https://datasheet.octopart.com:443/SN74LVC125APWR.-Texas-Instruments-datasheet-48051172.pdf?src-supplier=Farnell; ComponentLink12Description: https://datasheet.octopart.com:443/SN74LVC125APWR.-Texas-Instruments-datasheet-48051172.pdf?src-supplier=Farnell; ComponentLink13URL: https://datasheet.octopart.com:443/SN74LVC125APWR-Texas-Instruments-datasheet-10079432.pdf?src-supplier=Farnell; ComponentLink13Description: https://datasheet.octopart.com:443/SN74LVC125APWR-Texas-Instruments-datasheet-10079432.pdf?src-supplier=Farnell; ComponentLink14URL: https://datasheet.octopart.com:443/SN74LVC125APWR-Texas-Instruments-datasheet-8703072.pdf?src-supplier=Farnell; ComponentLink14Description: https://datasheet.octopart.com:443/SN74LVC125APWR-Texas-Instruments-datasheet-8703072.pdf?src-supplier=Farnell; ComponentLink15URL: https://datasheet.octopart.com:443/SN74LVC125APWR-Texas-Instruments-datasheet-8702091.pdf?src-supplier=Farnell; ComponentLink15Description: https://datasheet.octopart.com:443/SN74LVC125APWR-Texas-Instruments-datasheet-8702091.pdf?src-supplier=Farnell; ComponentLink16URL: https://datasheet.octopart.com:443/SN74LVC125APWR-Texas-Instruments-datasheet-8636213.pdf?src-supplier=Farnell; ComponentLink16Description: https://datasheet.octopart.com:443/SN74LVC125APWR-Texas-Instruments-datasheet-8636213.pdf?src-supplier=Farnell; ComponentLink17URL: https://datasheet.octopart.com:443/SN74LVC125APWR-Texas-Instruments-datasheet-7836027.pdf?src-supplier=Farnell; ComponentLink17Description: https://datasheet.octopart.com:443/SN74LVC125APWR-Texas-Instruments-datasheet-7836027.pdf?src-supplier=Farnell; ComponentLink18URL: https://datasheet.octopart.com:443/SN74LVC125APWR-Texas-Instruments-datasheet-7543160.pdf?src-supplier=Farnell; ComponentLink18Description: https://datasheet.octopart.com:443/SN74LVC125APWR-Texas-Instruments-datasheet-7543160.pdf?src-supplier=Farnell; ComponentLink19URL: https://datasheet.octopart.com:443/SN74LVC125APWR-Texas-Instruments-datasheet-5319739.pdf?src-supplier=Farnell; ComponentLink19Description: https://datasheet.octopart.com:443/SN74LVC125APWR-Texas-Instruments-datasheet-5319739.pdf?src-supplier=Farnell; ComponentLink20URL: https://datasheet.octopart.com:443/SN74LVC125APWR-Texas-Instruments-datasheet-21221564.pdf?src-supplier=Upverter; ComponentLink20Description: https://datasheet.octopart.com:443/SN74LVC125APWR-Texas-Instruments-datasheet-21221564.pdf?src-supplier=Upverter; ComponentLink21URL: https://datasheet.octopart.com:443/SN74LVC125APWR-Texas-Instruments-datasheet-62118761.pdf?src-supplier=Newark; ComponentLink21Description: https://datasheet.octopart.com:443/SN74LVC125APWR-Texas-Instruments-datasheet-62118761.pdf?src-supplier=Newark; ComponentLink22URL: https://datasheet.octopart.com:443/SN74LVC125APWR-Texas-Instruments-datasheet-79172.pdf?src-supplier=Newark; ComponentLink22Description: https://datasheet.octopart.com:443/SN74LVC125APWR-Texas-Instruments-datasheet-79172.pdf?src-supplier=Newark; ComponentLink23URL: https://datasheet.octopart.com:443/SN74LVC125APWR-Texas-Instruments-datasheet-33018789.pdf?src-supplier=element14+APAC; ComponentLink23Description: https://datasheet.octopart.com:443/SN74LVC125APWR-Texas-Instruments-datasheet-33018789.pdf?src-supplier=element14+APAC; ComponentLink24URL: https://datasheet.octopart.com:443/SN74LVC125APWR-Texas-Instruments-datasheet-166100981.pdf?src-supplier=Augswan; ComponentLink24Description: https://datasheet.octopart.com:443/SN74LVC125APWR-Texas-Instruments-datasheet-166100981.pdf?src-supplier=Augswan; ComponentLink25URL: https://datasheet.octopart.com:443/SN74LVC125APWR-Texas-Instruments-datasheet-159116505.pdf?src-supplier=LCSC; ComponentLink25Description: https://datasheet.octopart.com:443/SN74LVC125APWR-Texas-Instruments-datasheet-159116505.pdf?src-supplier=LCSC; ComponentLink26URL: https://datasheet.octopart.com:443/SN74LVC125APWR-Texas-Instruments-datasheet-147835652.pdf?src-supplier=SHENGYU+ELECTRONICS; ComponentLink26Description: https://datasheet.octopart.com:443/SN74LVC125APWR-Texas-Instruments-datasheet-147835652.pdf?src-supplier=SHENGYU+ELECTRONICS; ComponentLink27URL: https://datasheet.octopart.com:443/SN74LVC125APWR-Texas-Instruments-datasheet-14144586.pdf?src-supplier=iiiC; ComponentLink27Description: https://datasheet.octopart.com:443/SN74LVC125APWR-Texas-Instruments-datasheet-14144586.pdf?src-supplier=iiiC; ComponentLink28URL: https://datasheet.octopart.com:443/SN74LVC125APWR-Texas-Instruments-datasheet-11536687.pdf?src-supplier=Arrow+Electronics; ComponentLink28Description: https://datasheet.octopart.com:443/SN74LVC125APWR-Texas-Instruments-datasheet-11536687.pdf?src-supplier=Arrow+Electronics; ComponentLink29URL: https://datasheet.octopart.com:443/SN74LVC125APWR-Texas-Instruments-datasheet-7542750.pdf?src-supplier=Jameco; ComponentLink29Description: https://datasheet.octopart.com:443/SN74LVC125APWR-Texas-Instruments-datasheet-7542750.pdf?src-supplier=Jameco; ComponentLink30URL: https://datasheet.octopart.com:443/SN74LVC125APWR-Texas-Instruments-datasheet-114787.pdf?src-supplier=Sierra+IC; ComponentLink30Description: https://datasheet.octopart.com:443/SN74LVC125APWR-Texas-Instruments-datasheet-114787.pdf?src-supplier=Sierra+IC; ComponentLink31URL: https://datasheet.octopart.com:443/SN74LVC125APWR-Texas-Instruments-datasheet-32983.pdf?src-supplier=DigiKey; ComponentLink31Description: https://datasheet.octopart.com:443/SN74LVC125APWR-Texas-Instruments-datasheet-32983.pdf?src-supplier=DigiKey; ComponentLink32URL: http://sigma.octopart.com:80/conflict_mineral_statement/Texas-Instruments-company-63.pdf?src-supplier=Compliance+Statements; ComponentLink32Description: http://sigma.octopart.com:80/conflict_mineral_statement/Texas-Instruments-company-63.pdf?src-supplier=Compliance+Statements; ComponentLink33URL: http://sigma.octopart.com:80/reach_statement/Texas-Instruments-company-64.pdf?src-supplier=Compliance+Statements; ComponentLink33Description: http://sigma.octopart.com:80/reach_statement/Texas-Instruments-company-64.pdf?src-supplier=Compliance+Statements; LCSC Part Number: C7813